# Altium schematic sheet IO_Expander.SchDoc
size A3; SheetNumber: 5; SheetTotal: 16
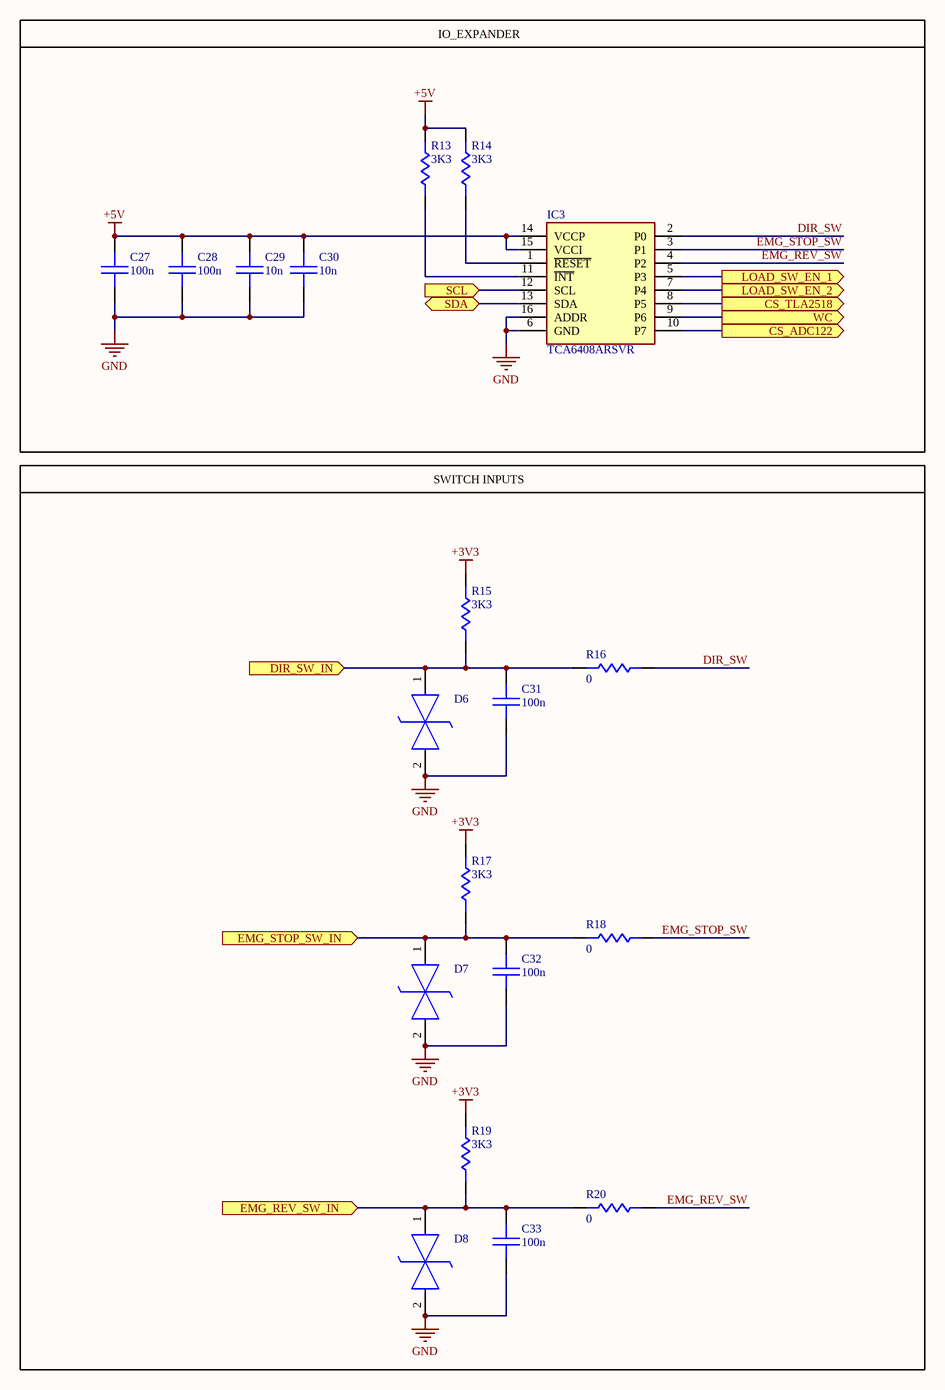
[diagram p0: IO_Expander.SchDoc]

## Parts
C27  100n  [C_0603]
C28  100n  [C_0603]
C29  10n  [C_0603]
C30  10n  [C_0603]
C31  100n  [C_0603]
C32  100n  [C_0603]
C33  100n  [C_0603]
D6  PESD3V3Y1BSFYL  [PMEG3005AESFYL]  (value not drawn)
D7  PESD3V3Y1BSFYL  [PMEG3005AESFYL]  (value not drawn)
D8  PESD3V3Y1BSFYL  [PMEG3005AESFYL]  (value not drawn)
IC3  TCA6408ARSVR  [QFN40P180X260X55-16N]
R13  3K3  [R_0603]
R14  3K3  [R_0603]
R15  3K3  [R_0603]
R16  0  [R_0603]
R17  3K3  [R_0603]
R18  0  [R_0603]
R19  3K3  [R_0603]
R20  0  [R_0603]

## Blocks framed on the sheet
IO_EXPANDER: C27-C30 IC3 R13 R14
SWITCH INPUTS: C31-C33 D6-D8 R15-R20

## Ports
CS_ADC122 (out, see Interconnections[3A], AD_Converter[3B]), CS_TLA2518 (out, see Interconnections[3A], AD_Converter[2A]), DIR_SW_IN (in, see Interconnections[2A], Main_Connector[1B]), EMG_REV_SW_IN (in, see Interconnections[2A], Main_Connector[1B]), EMG_STOP_SW_IN (in, see Interconnections[2A], Main_Connector[1B]), LOAD_SW_EN_1 (out, see Interconnections[3A], Load_Switches[1A]), LOAD_SW_EN_2 (out, see Interconnections[3A], Load_Switches[1B]), SCL (in, see Interconnections[3A], Eeprom[1A], Isolator_I2C[2A]), SDA (bidir, see Interconnections[3A], Eeprom[1A], Isolator_I2C[2A]), WC (out, see Interconnections[3A], Eeprom[1A])

## Nets
+3V3: R15.2 R17.2 R19.2
+5V: C27.1 C28.1 C29.1 C30.1 IC3.14(VCCP) IC3.15(VCCI) R13.2 R14.2
GND: C27.2 C28.2 C29.2 C30.2 C31.2 C32.2 C33.2 D6.2(K2) D7.2(K2) D8.2(K2) IC3.6(GND) IC3.16(ADDR)
CS_ADC122: IC3.10(P7) ; port CS_ADC122
CS_TLA2518: IC3.8(P5) ; port CS_TLA2518
DIR_SW: IC3.2(P0) R16.1
DIR_SW_IN: C31.1 D6.1(K1) R15.1 R16.2 ; port DIR_SW_IN
EMG_REV_SW: IC3.4(P2) R20.1
EMG_REV_SW_IN: C33.1 D8.1(K1) R19.1 R20.2 ; port EMG_REV_SW_IN
EMG_STOP_SW: IC3.3(P1) R18.1
EMG_STOP_SW_IN: C32.1 D7.1(K1) R17.1 R18.2 ; port EMG_STOP_SW_IN
LOAD_SW_EN_1: IC3.5(P3) ; port LOAD_SW_EN_1
LOAD_SW_EN_2: IC3.7(P4) ; port LOAD_SW_EN_2
SCL: IC3.12(SCL) ; port SCL
SDA: IC3.13(SDA) ; port SDA
WC: IC3.9(P6) ; port WC
NetIC3_1: IC3.1(~{RESET}) R14.1
NetIC3_11: IC3.11(~{INT}) R13.1

## Library data of the parts
C27-C33 = CAP: SMD Chip Capacitor
D6-D8 = PESD3V3Y1BSFYL: Diode ESD (Bi-directional); Manufacturer_Name: Nexperia; Datasheet Link: https://assets.nexperia.com/documents/data-sheet/PESD3V3Y1BSF.pdf; Manufacturer_Part_Number: PESD3V3Y1BSFYL; Mouser Part Number: 771-PESD3V3Y1BSFYL; Mouser Price/Stock: https://www.mouser.co.uk/ProductDetail/Nexperia/PESD3V3Y1BSFYL?qs=MLItCLRbWswJ%2F2jJIhlIxQ%3D%3D; Arrow Part Number: PESD3V3Y1BSFYL; Arrow Price/Stock: https://www.arrow.com/en/products/pesd3v3y1bsfyl/nexperia?region=asia
IC3 = TCA6408ARSVR: Integrated Circuit; Manufacturer_Name: Texas Instruments; Datasheet Link: http://www.ti.com/lit/gpn/tca6408a; Height: 0.55mm; Manufacturer_Part_Number: TCA6408ARSVR; Mouser Part Number: 595-TCA6408ARSVR; Mouser Price/Stock: https://www.mouser.co.uk/ProductDetail/Texas-Instruments/TCA6408ARSVR?qs=AFkNxQkJKAISZm6jGsM%252BSQ%3D%3D; Arrow Part Number: TCA6408ARSVR; Arrow Price/Stock: https://www.arrow.com/en/products/tca6408arsvr/texas-instruments?region=nac
R13-R20 = RES: SMD Chip Resistor